# Altium project stm32.PrjPCB
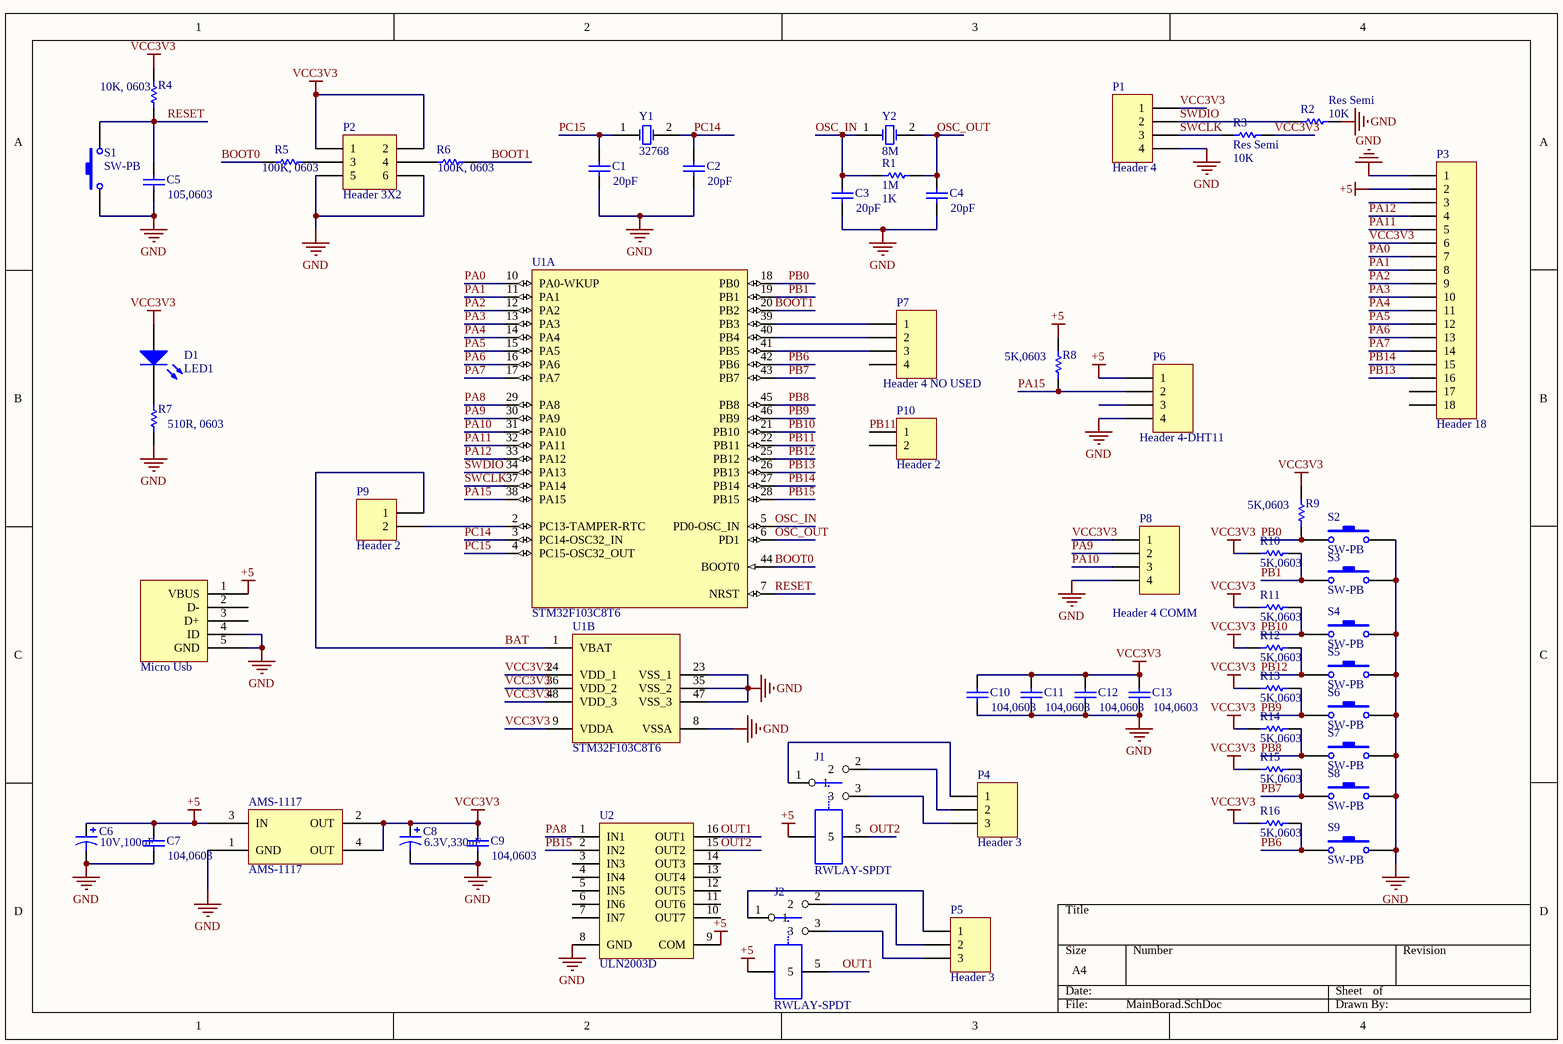
[diagram p0: MainBorad.SchDoc]
1 sheet, 57 parts. Net scope: global (net labels, ports and power ports of the same name join across sheets).
Board file: MainBoard.PcbDoc

## Sheet MainBorad.SchDoc
size A4

### Parts
AMS-1117  AMS-1117  [SOT223]
C1  value 20pF  [0805C]  (hidden comment: Cap Semi)
C2  value 20pF  [0805C]  (hidden comment: Cap Semi)
C3  value 20pF  [0805C]  (hidden comment: Cap Semi)
C4  value 20pF  [0805C]  (hidden comment: Cap Semi)
C5  value 105,0603  [0805C]  (hidden comment: Cap Semi)
C6  value 10V,100uF  [7343C]  (hidden comment: Cap Pol3)
C7  value 104,0603  [0805C]  (hidden comment: Cap Semi)
C8  6.3V,330uF  [7343C]
C9  value 104,0603  [0805C]  (hidden comment: Cap Semi)
C10  value 104,0603  [0805C]  (hidden comment: Cap Semi)
C11  value 104,0603  [0805C]  (hidden comment: Cap Semi)
C12  value 104,0603  [0805C]  (hidden comment: Cap Semi)
C13  value 104,0603  [0805C]  (hidden comment: Cap Semi)
D1  LED1  [0805]
J1  RWLAY-SPDT  [relay]
J2  RWLAY-SPDT  [relay]
Micro_Usb  Micro Usb  [Micro_USB]  (value not drawn)
P1  Header 4  [HDR1X4]
P2  Header 3X2  [HDR2X3]
P3  Header 18  [HDR1X18]
P4  Header 3  [HDR1X3]
P5  Header 3  [HDR1X3]
P6  Header 4-DHT11  [HDR1X4]
P7  Header 4 NO USED  [HDR1X4]
P8  Header 4 COMM  [HDR1X4]
P9  Header 2  [HDR1X2]
P10  Header 2  [HDR1X2]
R1  1M  value 1K  [0805R]
R2  Res Semi  value 10K  [0805R]
R3  Res Semi  value 10K  [0805R]
R4  value 10K, 0603  [0805R]  (hidden comment: Res Semi)
R5  value 100K, 0603  [0805R]  (hidden comment: Res Semi)
R6  value 100K, 0603  [0805R]  (hidden comment: Res Semi)
R7  value 510R, 0603  [0805R]  (hidden comment: Res Semi)
R8  value 5K,0603  [0805R]  (hidden comment: Res Semi)
R9  value 5K,0603  [0805R]  (hidden comment: Res Semi)
R10  value 5K,0603  [0805R]  (hidden comment: Res Semi)
R11  value 5K,0603  [0805R]  (hidden comment: Res Semi)
R12  value 5K,0603  [0805R]  (hidden comment: Res Semi)
R13  value 5K,0603  [0805R]  (hidden comment: Res Semi)
R14  value 5K,0603  [0805R]  (hidden comment: Res Semi)
R15  value 5K,0603  [0805R]  (hidden comment: Res Semi)
R16  value 5K,0603  [0805R]  (hidden comment: Res Semi)
S1  SW-PB  [SPST-2]
S2  SW-PB  [SPST-2]
S3  SW-PB  [SPST-2]
S4  SW-PB  [SPST-2]
S5  SW-PB  [SPST-2]
S6  SW-PB  [SPST-2]
S7  SW-PB  [SPST-2]
S8  SW-PB  [SPST-2]
S9  SW-PB  [SPST-2]
U1  STM32F103C8T6  [LQFP48_N]  (parts A,B of 2)
U2  ULN2003D  [SO16_N]
Y1  32768  [R38]
Y2  8M  [XTAL1]

### Nets
+5: AMS-1117.3(IN) C6.1 C7.2 J1.4 J2.4 Micro_Usb.1(VBUS) P3.2 P6.1 R8.2 U2.9(COM)
GND: AMS-1117.1(GND) C1.1 C2.1 C3.1 C4.1 C5.1 C6.2 C7.1 C8.2 C9.1 C10.1 C11.1 C12.1 C13.1 Micro_Usb.4(ID) Micro_Usb.5(GND) P1.4 P2.5 P2.6 P3.1 P6.4 P8.4 R2.1 R7.1 S1.1 S2.2 S3.2 S4.2 S5.2 S6.2 S7.2 S8.2 S9.2 U1.8(VSSA) U1.23(VSS_1) U1.35(VSS_2) U1.47(VSS_3) U2.8(GND)
VCC3V3: AMS-1117.2(OUT) AMS-1117.4(OUT) C8.1 C9.2 C10.2 C11.2 C12.2 C13.2 D1.1(A) P1.1 P2.1 P2.2 P3.6 P8.1 R3.1 R4.2 R9.2 R10.2 R11.2 R12.2 R13.2 R14.2 R15.2 R16.2 U1.9(VDDA) U1.24(VDD_1) U1.36(VDD_2) U1.48(VDD_3)
BAT: P9.1 U1.1(VBAT)
BOOT0: R5.2 U1.44(BOOT0)
BOOT1: R6.1 U1.20(PB2)
OSC_IN: C3.2 R1.1 U1.5(PD0-OSC_IN) Y2.1(OSC1)
OSC_OUT: C4.2 R1.2 U1.6(PD1) Y2.2(OSC2)
OUT1: J2.5 U2.16(OUT1)
OUT2: J1.5 U2.15(OUT2)
PA0: P3.7 U1.10(PA0-WKUP)
PA1: P3.8 U1.11(PA1)
PA2: P3.9 U1.12(PA2)
PA3: P3.10 U1.13(PA3)
PA4: P3.11 U1.14(PA4)
PA5: P3.12 U1.15(PA5)
PA6: P3.13 U1.16(PA6)
PA7: P3.14 U1.17(PA7)
PA8: U1.29(PA8) U2.1(IN1)
PA9: P8.2 U1.30(PA9)
PA10: P8.3 U1.31(PA10)
PA11: P3.5 U1.32(PA11)
PA12: P3.4 U1.33(PA12)
PA15: P6.2 R8.1 U1.38(PA15)
PB0: R9.1 S2.1 U1.18(PB0)
PB1: R10.1 S3.1 U1.19(PB1)
PB6: R16.1 S9.1 U1.42(PB6)
PB7: R15.1 S8.1 U1.43(PB7)
PB8: R14.1 S7.1 U1.45(PB8)
PB9: R13.1 S6.1 U1.46(PB9)
PB10: R11.1 S4.1 U1.21(PB10)
PB11: P10.1 U1.22(PB11)
PB12: R12.1 S5.1 U1.25(PB12)
PB13: P3.16 U1.26(PB13)
PB14: P3.15 U1.27(PB14)
PB15: U1.28(PB15) U2.2(IN2)
PC14: C2.2 U1.3(PC14-OSC32_IN) Y1.2(OSC2)
PC15: C1.2 U1.4(PC15-OSC32_OUT) Y1.1(OSC1)
RESET: C5.2 R4.1 S1.2 U1.7(NRST)
SWCLK: P1.3 R3.2 U1.37(PA14)
SWDIO: P1.2 R2.2 U1.34(PA13)
NetD1_2: D1.2(K) R7.2
NetJ1_1: J1.1 P4.1
NetJ1_2: J1.2 P4.2
NetJ1_3: J1.3 P4.3
NetJ2_1: J2.1 P5.1
NetJ2_2: J2.2 P5.2
NetJ2_3: J2.3 P5.3
NetP2_3: P2.3 R5.1
NetP2_4: P2.4 R6.2
NetP7_1: P7.1 U1.39(PB3)
NetP7_2: P7.2 U1.40(PB4)
NetP7_3: P7.3 U1.41(PB5)
NetP9_2: P9.2 U1.2(PC13-TAMPER-RTC)

Not connected (* = marked no-connect by the designer): Micro_Usb 2(D-) 3(D+); P3 3 17 18; P6 3; P7 4; P10 2; U2 3(IN3) 4(IN4) 5(IN5) 6(IN6) 7(IN7) 10(OUT7) 11(OUT6) 12(OUT5) 13(OUT4) 14(OUT3)

### Library data of the parts
C1-C5 C7 C9-C13 = Cap Semi: Capacitor (Semiconductor SIM Model); Published: 8-Jun-2000; LatestRevisionDate: 29-May-2009; LatestRevisionNote: IPC-7351 Footprint Added.; PackageReference: C1206; Publisher: Altium Limited; PackageDescription: Chip Capacitor
C6 C8 = Cap Pol3: Polarized Capacitor (Surface Mount); Published: 8-Jun-2000; LatestRevisionDate: 29-May-2009; LatestRevisionNote: IPC-7351 Footprint Added.; PackageReference: C0805; Publisher: Altium Limited; PackageDescription: Chip Capacitor
  C8: Value: 6.3V,330uF
D1 = LED1: Typical RED GaAs LED; Published: 8-Jun-2000; LatestRevisionDate: 08-Jul-2005; LatestRevisionNote: Mech Layer 1 removed.; PackageReference: LED-1; Publisher: Altium Limited; PackageDescription: LED; 2 Leads
P1 P6-P8 = Header 4: Header, 4-Pin; LatestRevisionDate: 17-Jul-2002; LatestRevisionNote: Re-released for DXP Platform.; Publisher: Altium Limited
P2 = Header 3X2: Header, 3-Pin, Dual row; LatestRevisionDate: 17-Jul-2002; LatestRevisionNote: Re-released for DXP Platform.; Publisher: Altium Limited
P3 = Header 18: Header, 18-Pin; LatestRevisionDate: 17-Jul-2002; LatestRevisionNote: Re-released for DXP Platform.; Publisher: Altium Limited
P4 P5 = Header 3: Header, 3-Pin; LatestRevisionDate: 17-Jul-2002; LatestRevisionNote: Re-released for DXP Platform.; Publisher: Altium Limited
P9 P10 = Header 2: Header, 2-Pin; LatestRevisionDate: 17-Jul-2002; LatestRevisionNote: Re-released for DXP Platform.; Publisher: Altium Limited
R1-R16 = Res Semi: Semiconductor Resistor; Published: 8-Jun-2000; LatestRevisionDate: 17-Jul-2002; LatestRevisionNote: Re-released for DXP Platform.; PackageReference: AXIAL-0.5; Publisher: Altium Limited; PackageDescription: Axial Device, Thru-Hole; 2 Leads; 0.5 in Pin Spacing
S1-S9 = SW-PB: Switch; Published: 24-Mar-1999; LatestRevisionDate: 17-Jul-2002; LatestRevisionNote: Re-released for DXP Platform.; PackageReference: SPST-2; Publisher: Altium Limited; PackageDescription: Switch; 2 Leads
U1 = STM32F103C8T6: STM32 ARM-based 32-bit MCU Performance Line with 64 kB Flash, 20 kB Internal RAM, -40 to +85°C Temperature, 48-Pin LQFP, Tray; DatasheetVersion: rev13.0, Apr-2011; PackageVersion: rev13, Apr-2011; PackageReference: LQFP48; PackageDescription: 48-Pin Low-Profile Quad Flat Pack, 7 x 7 mm Body, 0.5 mm Pitch (LQFP48); ComponentLink1Description: Manufacturer URL; ComponentLink1URL: http://www.st.com/; ComponentLink2Description: STM32F103 Datasheet; ComponentLink2URL: http://www.st.com/internet/com/TECHNICAL_RESOURCES/TECHNICAL_LITERATURE/DATASHEET/CD00161566.pdf; ComponentLink3Description: STM32 Family Web Page; ComponentLink3URL: www.st.com/stm32
U2 = ULN2003D: Seven Darlington Array; Published: 8-Jun-2000; LatestRevisionDate: 13-Apr-2006; LatestRevisionNote: IPC-7351 Footprint Added.; DatasheetVersion: Sep-1998; PackageVersion: May-1998; PackageReference: SO16; Publisher: Altium Limited; PackageDescription: 16-Pin Small Outline Integrated Circuit 1.27 mm Pitch; Code_IPC: SOIC127P600-16; ComponentLink1Description: Manufacturer Link; ComponentLink1URL: http://www.st.com/; ComponentLink2Description: Datasheet; ComponentLink2URL: http://www.st.com/stonline/products/literature/ds/5279/uln2001.pdf
Y1 Y2 = XTAL: Crystal Oscillator; Published: 8-Jun-2000; LatestRevisionDate: 17-Jul-2002; LatestRevisionNote: Re-released for DXP Platform.; PackageReference: R38; Publisher: Altium Limited; PackageDescription: Crystal, Thru-Hole; 2 Leads; Body 3.1 x 8.2 mm (Dia.xH)